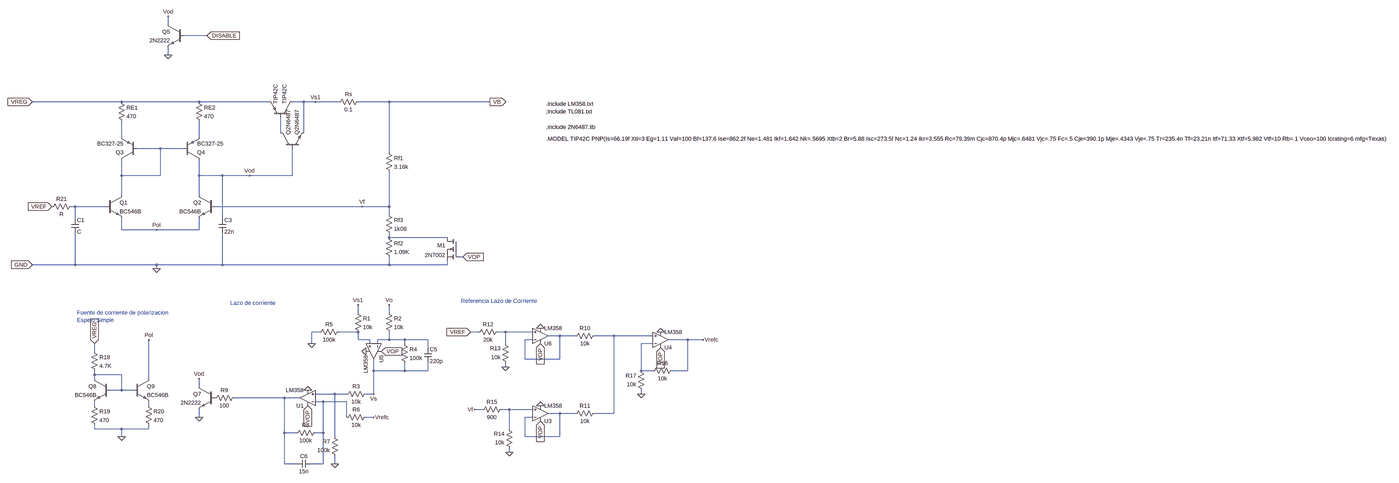
[diagram p0: schematic LDOB.asc, whole sheet]
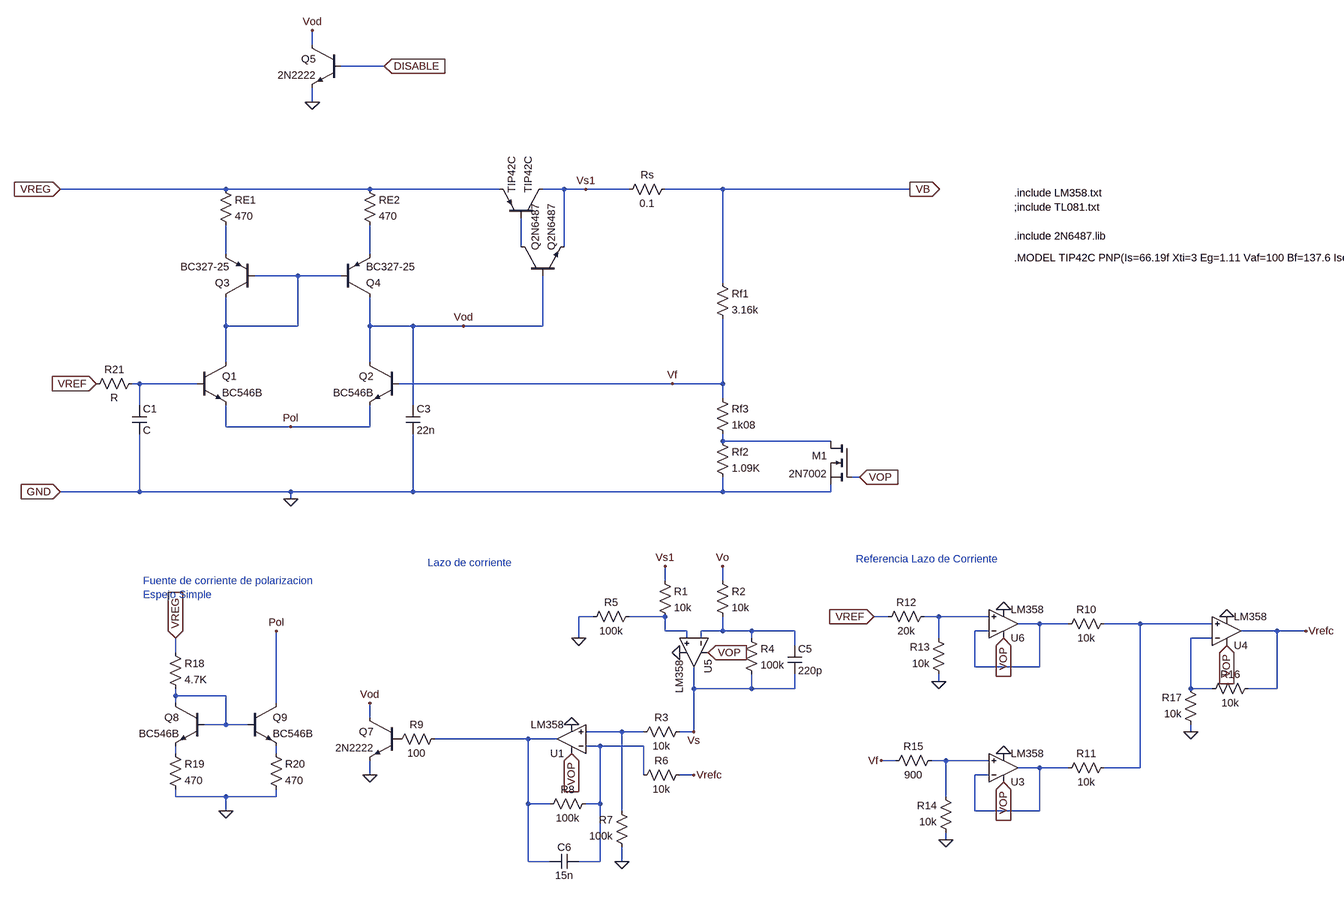
[diagram p1: schematic LDOB.asc, part, row 1 of 1, column 1 of 2]
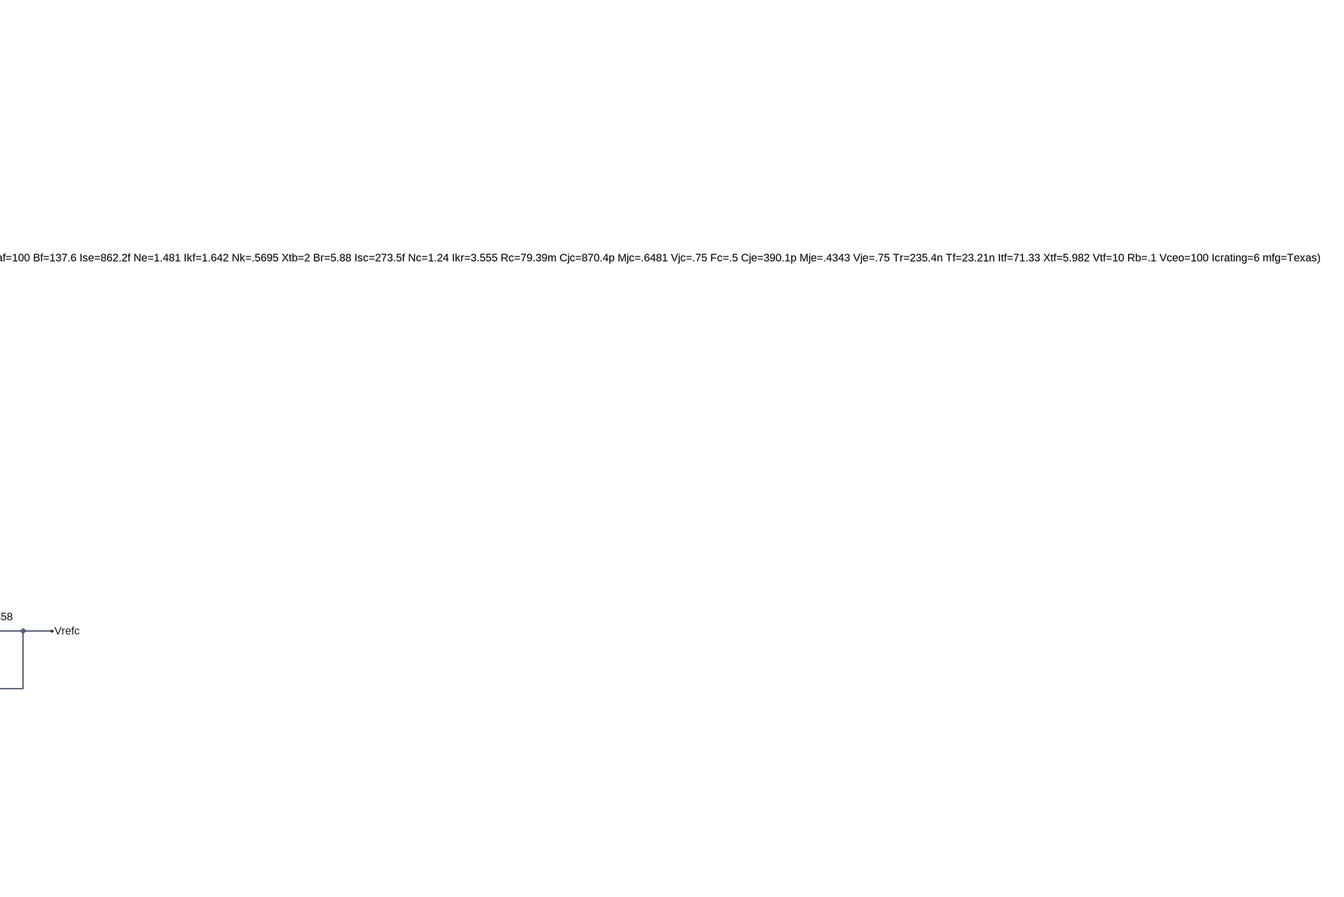
[diagram p2: schematic LDOB.asc, part, row 1 of 1, column 2 of 2]
LDOB.asc, the LTspice schematic file:
Version 4
SHEET 1 6120 1580
WIRE -304 -896 -304 -928
WIRE -144 -848 -240 -848
WIRE -304 -768 -304 -800
WIRE -496 -528 -864 -528
WIRE -176 -528 -496 -528
WIRE 112 -528 -176 -528
WIRE 256 -528 208 -528
WIRE 304 -528 256 -528
WIRE 400 -528 304 -528
WIRE 608 -528 480 -528
WIRE 1024 -528 608 -528
WIRE 160 -400 160 -464
WIRE 256 -400 256 -528
WIRE -496 -384 -496 -448
WIRE -176 -384 -176 -448
WIRE -336 -336 -432 -336
WIRE -240 -336 -336 -336
WIRE 608 -320 608 -528
WIRE -496 -224 -496 -288
WIRE -336 -224 -336 -336
WIRE -336 -224 -496 -224
WIRE -176 -224 -176 -288
WIRE -80 -224 -176 -224
WIRE 32 -224 -80 -224
WIRE 208 -224 208 -336
WIRE 208 -224 32 -224
WIRE -496 -144 -496 -224
WIRE -176 -144 -176 -224
WIRE -688 -96 -704 -96
WIRE -560 -96 -688 -96
WIRE 496 -96 -112 -96
WIRE 608 -96 608 -240
WIRE 608 -96 496 -96
WIRE 608 -64 608 -96
WIRE -688 -48 -688 -96
WIRE -80 -48 -80 -224
WIRE -496 0 -496 -48
WIRE -352 0 -496 0
WIRE -176 0 -176 -48
WIRE -176 0 -352 0
WIRE 608 32 608 16
WIRE 848 32 608 32
WIRE 912 112 896 112
WIRE -688 144 -688 16
WIRE -688 144 -864 144
WIRE -352 144 -688 144
WIRE -80 144 -80 16
WIRE -80 144 -352 144
WIRE 608 144 608 112
WIRE 608 144 -80 144
WIRE 848 144 848 128
WIRE 848 144 608 144
WIRE -352 160 -352 144
WIRE 480 480 480 448
WIRE 608 480 608 448
WIRE 320 560 288 560
WIRE 480 560 400 560
WIRE 976 560 944 560
WIRE 1088 560 1056 560
WIRE 1200 560 1088 560
WIRE 1312 576 1264 576
WIRE 1376 576 1312 576
WIRE 1536 576 1456 576
WIRE 1696 576 1536 576
WIRE 480 592 480 560
WIRE 528 592 480 592
WIRE 608 592 608 560
WIRE 608 592 560 592
WIRE 672 592 608 592
WIRE 768 592 672 592
WIRE 1200 592 1168 592
WIRE 1840 592 1760 592
WIRE 1904 592 1840 592
WIRE 288 608 288 560
WIRE 528 608 528 592
WIRE 560 608 560 592
WIRE 672 608 672 592
WIRE 1088 608 1088 560
WIRE 1696 608 1648 608
WIRE 768 624 768 592
WIRE -608 640 -608 608
WIRE 1168 672 1168 592
WIRE 1312 672 1312 576
WIRE 1312 672 1168 672
WIRE 1088 704 1088 688
WIRE 544 720 544 672
WIRE 672 720 672 688
WIRE 672 720 544 720
WIRE 768 720 768 688
WIRE 768 720 672 720
WIRE 1648 720 1648 608
WIRE 1696 720 1648 720
WIRE 1840 720 1840 592
WIRE 1840 720 1776 720
WIRE -608 736 -608 720
WIRE -496 736 -608 736
WIRE -608 752 -608 736
WIRE -384 752 -384 592
WIRE -176 784 -176 752
WIRE -496 800 -496 736
WIRE -496 800 -544 800
WIRE -448 800 -496 800
WIRE 384 816 304 816
WIRE 432 816 384 816
WIRE 544 816 544 720
WIRE 544 816 512 816
WIRE 1648 816 1648 800
WIRE 176 832 -32 832
WIRE 240 832 176 832
WIRE 336 848 304 848
WIRE 432 848 336 848
WIRE -608 864 -608 848
WIRE -384 864 -384 848
WIRE 992 880 960 880
WIRE 1104 880 1072 880
WIRE 1200 880 1104 880
WIRE 1312 896 1264 896
WIRE 1376 896 1312 896
WIRE 1536 896 1536 576
WIRE 1536 896 1456 896
WIRE -176 912 -176 880
WIRE 432 912 432 848
WIRE 544 912 512 912
WIRE 1200 912 1168 912
WIRE -608 960 -608 944
WIRE -496 960 -608 960
WIRE -384 960 -384 944
WIRE -384 960 -496 960
WIRE 1104 960 1104 880
WIRE 176 976 176 832
WIRE 224 976 176 976
WIRE 336 976 336 848
WIRE 336 976 304 976
WIRE -496 992 -496 960
WIRE 384 992 384 816
WIRE 1168 992 1168 912
WIRE 1312 992 1312 896
WIRE 1312 992 1168 992
WIRE 1104 1056 1104 1040
WIRE 176 1104 176 976
WIRE 224 1104 176 1104
WIRE 336 1104 336 976
WIRE 336 1104 288 1104
WIRE 384 1104 384 1072
FLAG -352 160 0
FLAG 32 -224 Vod
FLAG 496 -96 Vf
FLAG 304 -528 Vs1
FLAG 288 608 0
FLAG 384 1104 0
FLAG -176 912 0
FLAG -176 752 Vod
FLAG 544 816 Vs
FLAG 544 912 Vrefc
FLAG 480 448 Vs1
FLAG 608 448 Vo
FLAG 1088 704 0
FLAG 1104 1056 0
FLAG 1648 816 0
FLAG 960 880 Vf
FLAG 1904 592 Vrefc
FLAG -384 592 Pol
FLAG -496 992 0
FLAG -352 0 Pol
FLAG 1232 544 0
FLAG 1232 864 0
FLAG 1728 560 0
FLAG 512 640 0
FLAG 272 800 0
FLAG 912 112 VOP
IOPIN 912 112 In
FLAG 272 864 VOP
IOPIN 272 864 In
FLAG 576 640 VOP
IOPIN 576 640 In
FLAG 1232 608 VOP
IOPIN 1232 608 In
FLAG 1232 928 VOP
IOPIN 1232 928 In
FLAG 1728 624 VOP
IOPIN 1728 624 In
FLAG 944 560 VREF
IOPIN 944 560 In
FLAG -784 -96 VREF
IOPIN -784 -96 In
FLAG -864 -528 VREG
IOPIN -864 -528 In
FLAG -608 608 VREG
IOPIN -608 608 In
FLAG 1024 -528 VB
IOPIN 1024 -528 Out
FLAG -304 -768 0
FLAG -304 -928 Vod
FLAG -144 -848 DISABLE
IOPIN -144 -848 In
FLAG -864 144 GND
IOPIN -864 144 In
SYMBOL npn -560 -144 R0
SYMATTR InstName Q1
SYMATTR Value BC546B
SYMBOL npn -112 -144 M0
SYMATTR InstName Q2
SYMATTR Value BC546B
SYMBOL pnp -432 -288 R180
SYMATTR InstName Q3
SYMATTR Value BC327-25
SYMBOL pnp -240 -288 M180
SYMATTR InstName Q4
SYMATTR Value BC327-25
SYMBOL res -512 -544 R0
SYMATTR InstName RE1
SYMATTR Value 470
SYMBOL res -192 -544 R0
SYMATTR InstName RE2
SYMATTR Value 470
SYMBOL pnp 208 -464 M270
SYMATTR InstName TIP42C
SYMATTR Value TIP42C
SYMBOL npn 160 -336 R270
SYMATTR InstName Q2N6487
SYMATTR Value Q2N6487
SYMBOL res 496 -544 R90
WINDOW 0 0 56 VBottom 2
WINDOW 3 32 56 VTop 2
SYMATTR InstName Rs
SYMATTR Value 0.1
SYMBOL res 592 -336 R0
SYMATTR InstName Rf1
SYMATTR Value 3.16k
SYMBOL res 592 -80 R0
SYMATTR InstName Rf3
SYMATTR Value 1k08
SYMBOL res 592 16 R0
SYMATTR InstName Rf2
SYMATTR Value 1.09K
SYMBOL nmos 896 32 M0
SYMATTR InstName M1
SYMATTR Value 2N7002
SYMBOL res 464 464 R0
SYMATTR InstName R1
SYMATTR Value 10k
SYMBOL res 592 464 R0
SYMATTR InstName R2
SYMATTR Value 10k
SYMBOL res 528 800 R90
WINDOW 0 0 56 VBottom 2
WINDOW 3 32 56 VTop 2
SYMATTR InstName R3
SYMATTR Value 10k
SYMBOL res 656 592 R0
SYMATTR InstName R4
SYMATTR Value 100k
SYMBOL res 416 544 R90
WINDOW 0 0 56 VBottom 2
WINDOW 3 32 56 VTop 2
SYMATTR InstName R5
SYMATTR Value 100k
SYMBOL res 528 896 R90
WINDOW 0 0 56 VBottom 2
WINDOW 3 32 56 VTop 2
SYMATTR InstName R6
SYMATTR Value 10k
SYMBOL res 400 1088 R180
WINDOW 0 36 76 Left 2
WINDOW 3 36 40 Left 2
SYMATTR InstName R7
SYMATTR Value 100k
SYMBOL res 208 992 R270
WINDOW 0 32 56 VTop 2
WINDOW 3 0 56 VBottom 2
SYMATTR InstName R8
SYMATTR Value 100k
SYMBOL res -128 848 R270
WINDOW 0 32 56 VTop 2
WINDOW 3 0 56 VBottom 2
SYMATTR InstName R9
SYMATTR Value 100
SYMBOL npn -112 784 M0
SYMATTR InstName Q7
SYMATTR Value 2N2222
SYMBOL res 1472 560 R90
WINDOW 0 0 56 VBottom 2
WINDOW 3 32 56 VTop 2
SYMATTR InstName R10
SYMATTR Value 10k
SYMBOL res 1472 880 R90
WINDOW 0 0 56 VBottom 2
WINDOW 3 32 56 VTop 2
SYMATTR InstName R11
SYMATTR Value 10k
SYMBOL res 1072 544 R90
WINDOW 0 0 56 VBottom 2
WINDOW 3 32 56 VTop 2
SYMATTR InstName R12
SYMATTR Value 20k
SYMBOL res 1104 704 R180
WINDOW 0 36 76 Left 2
WINDOW 3 36 40 Left 2
SYMATTR InstName R13
SYMATTR Value 10k
SYMBOL res 1120 1056 R180
WINDOW 0 36 76 Left 2
WINDOW 3 36 40 Left 2
SYMATTR InstName R14
SYMATTR Value 10k
SYMBOL res 976 896 R270
WINDOW 0 32 56 VTop 2
WINDOW 3 0 56 VBottom 2
SYMATTR InstName R15
SYMATTR Value 900
SYMBOL res 1792 704 R90
WINDOW 0 0 56 VBottom 2
WINDOW 3 32 56 VTop 2
SYMATTR InstName R16
SYMATTR Value 10k
SYMBOL res 1664 816 R180
WINDOW 0 36 76 Left 2
WINDOW 3 36 40 Left 2
SYMATTR InstName R17
SYMATTR Value 10k
SYMBOL npn -544 752 M0
SYMATTR InstName Q8
SYMATTR Value BC546B
SYMBOL res -624 624 R0
SYMATTR InstName R18
SYMATTR Value 4.7K
SYMBOL npn -448 752 R0
SYMATTR InstName Q9
SYMATTR Value BC546B
SYMBOL res -624 848 R0
SYMATTR InstName R19
SYMATTR Value 470
SYMBOL res -400 848 R0
SYMATTR InstName R20
SYMATTR Value 470
SYMBOL Opamps\\opamp2 1232 640 M180
SYMATTR InstName U6
SYMATTR Value LM358
SYMBOL Opamps\\opamp2 1232 960 M180
SYMATTR InstName U3
SYMATTR Value LM358
SYMBOL Opamps\\opamp2 1728 656 M180
SYMATTR InstName U4
SYMATTR Value LM358
SYMBOL Opamps\\opamp2 608 640 R90
SYMATTR InstName U5
SYMATTR Value LM358
SYMBOL Opamps\\opamp2 272 896 R180
SYMATTR InstName U1
SYMATTR Value LM358
SYMBOL cap -96 -48 R0
SYMATTR InstName C3
SYMATTR Value 22n
SYMBOL cap 752 624 R0
SYMATTR InstName C5
SYMATTR Value 220p
SYMBOL cap 288 1088 R90
WINDOW 0 0 32 VBottom 2
WINDOW 3 32 32 VTop 2
SYMATTR InstName C6
SYMATTR Value 15n
SYMBOL res -688 -112 R90
WINDOW 0 0 56 VBottom 2
WINDOW 3 32 56 VTop 2
SYMATTR InstName R21
SYMBOL cap -704 -48 R0
SYMATTR InstName C1
SYMBOL npn -240 -896 M0
SYMATTR InstName Q5
SYMATTR Value 2N2222
TEXT -48 440 Left 2 ;Lazo de corriente
TEXT 904 432 Left 2 ;Referencia Lazo de Corriente
TEXT -680 480 Left 2 ;Fuente de corriente de polarizacion\nEspejo Simple
TEXT 1256 -488 Left 2 !;include TL081.txt
TEXT 1256 -424 Left 2 !.include 2N6487.lib
TEXT 1256 -376 Left 2 !.MODEL TIP42C PNP(Is=66.19f Xti=3 Eg=1.11 Vaf=100 Bf=137.6 Ise=862.2f Ne=1.481 Ikf=1.642 Nk=.5695 Xtb=2 Br=5.88 Isc=273.5f Nc=1.24 Ikr=3.555 Rc=79.39m Cjc=870.4p Mjc=.6481 Vjc=.75 Fc=.5 Cje=390.1p Mje=.4343 Vje=.75 Tr=235.4n Tf=23.21n Itf=71.33 Xtf=5.982 Vtf=10 Rb=.1 Vceo=100 Icrating=6 mfg=Texas)
TEXT 1256 -520 Left 2 !.include LM358.txt

The netlist it stands for:
* LDOB.asc
Q1 N004 N005 Pol 0 BC546B
Q2 Vod Vf Pol 0 BC546B
Q3 N004 N004 N002 0 BC327-25
Q4 Vod N004 N003 0 BC327-25
RE1 VREG N002 470
RE2 VREG N003 470
Q§TIP42C Vs1 N001 VREG 0 TIP42C
Q2N6487 N001 Vod Vs1 0 Q2N6487
Rs VB Vs1 0.1
Rf1 VB Vf 3.16k
Rf3 Vf N006 1k08
Rf2 N006 0 1.09K
M1 N006 VOP 0 0 2N7002
R1 Vs1 N007 10k
R2 Vo N011 10k
R3 Vs N014 10k
R4 N011 Vs 100k
R5 N007 0 100k
R6 Vrefc N016 10k
R7 0 N014 100k
R8 N015 N016 100k
R9 P001 N015 100
Q7 Vod P001 0 0 2N2222
R10 N010 N009 10k
R11 N010 N020 10k
R12 N008 VREF 20k
R13 0 N008 10k
R14 0 N019 10k
R15 Vf N019 900
R16 Vrefc N012 10k
R17 0 N012 10k
Q8 N013 N013 N017 0 BC546B
R18 VREG N013 4.7K
Q9 Pol N013 N018 0 BC546B
R19 N017 0 470
R20 N018 0 470
XU6 N008 N009 VOP 0 N009 LM358  ; pins In+ In- V+ V- OUT
XU3 N019 N020 VOP 0 N020 LM358  ; pins In+ In- V+ V- OUT
XU4 N010 N012 VOP 0 Vrefc LM358  ; pins In+ In- V+ V- OUT
XU5 N007 N011 VOP 0 Vs LM358  ; pins In+ In- V+ V- OUT
XU1 N014 N016 VOP 0 N015 LM358  ; pins In+ In- V+ V- OUT
C3 Vod 0 22n
C5 N011 Vs 220p
C6 N016 N015 15n
R21 N005 VREF R
C1 N005 0 C
Q5 Vod DISABLE 0 0 2N2222
.model NPN NPN
.model PNP PNP
.lib standard.bjt
.model NMOS NMOS
.model PMOS PMOS
.lib standard.mos
* Lazo de corriente
* Referencia Lazo de Corriente
* Fuente de corriente de polarizacion
* Espejo Simple
;include TL081.txt
.include 2N6487.lib
.MODEL TIP42C PNP(Is=66.19f Xti=3 Eg=1.11 Vaf=100 Bf=137.6 Ise=862.2f Ne=1.481 Ikf=1.642 Nk=.5695 Xtb=2 Br=5.88 Isc=273.5f Nc=1.24 Ikr=3.555 Rc=79.39m Cjc=870.4p Mjc=.6481 Vjc=.75 Fc=.5 Cje=390.1p Mje=.4343 Vje=.75 Tr=235.4n Tf=23.21n Itf=71.33 Xtf=5.982 Vtf=10 Rb=.1 Vceo=100 Icrating=6 mfg=Texas)
.include LM358.txt
.backanno
.end